# Altium schematic sheet ControllerBoard.SchDoc
size A2
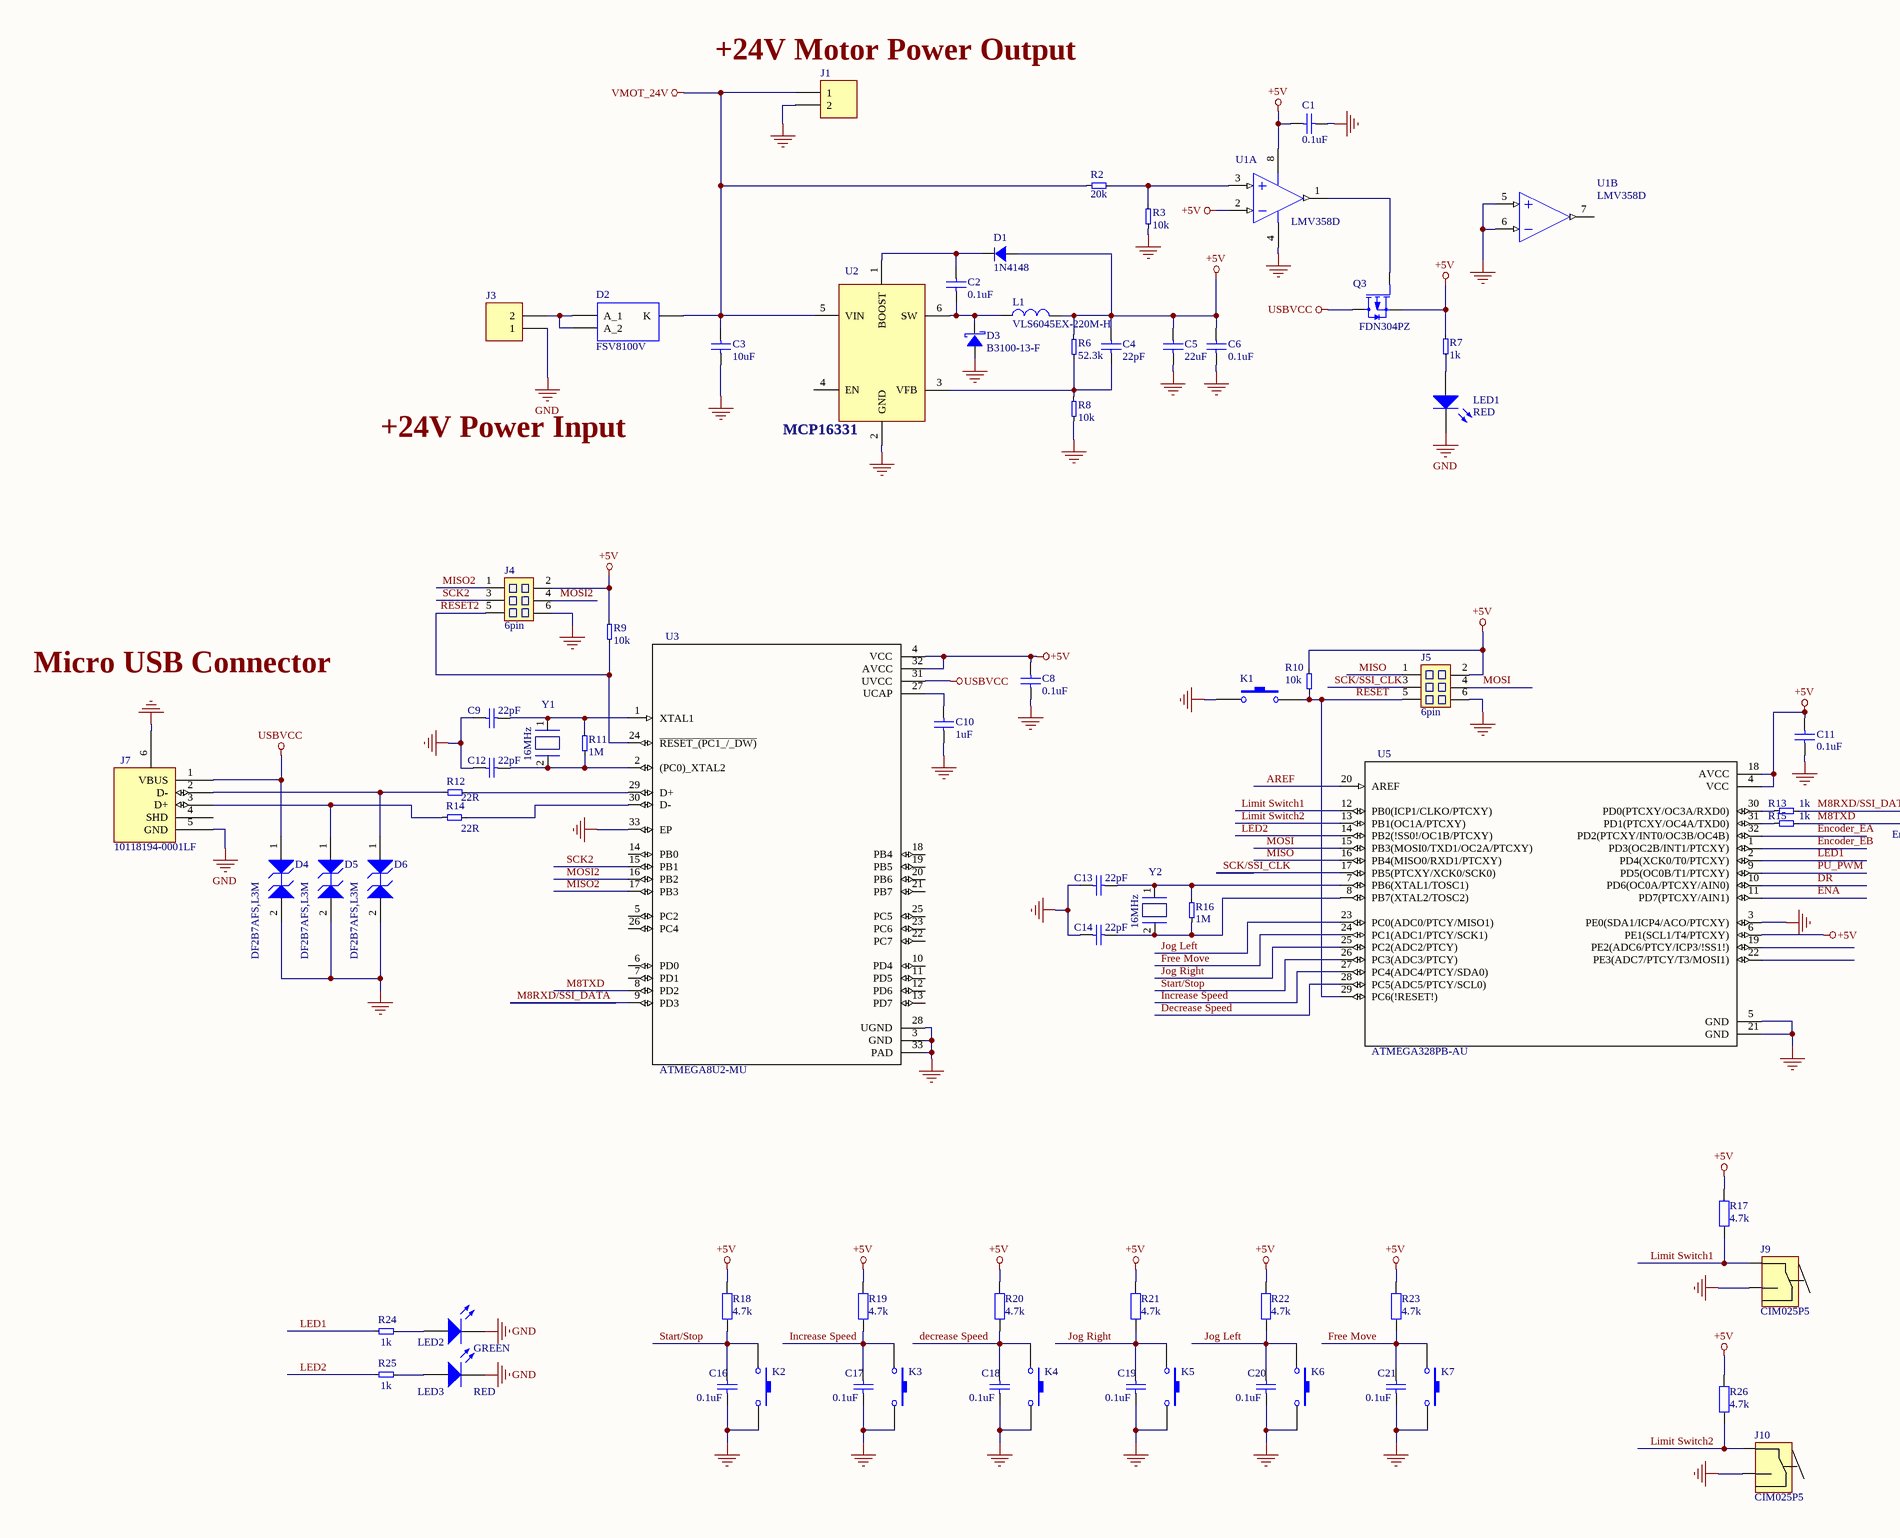
[diagram p0: ControllerBoard.SchDoc, left]
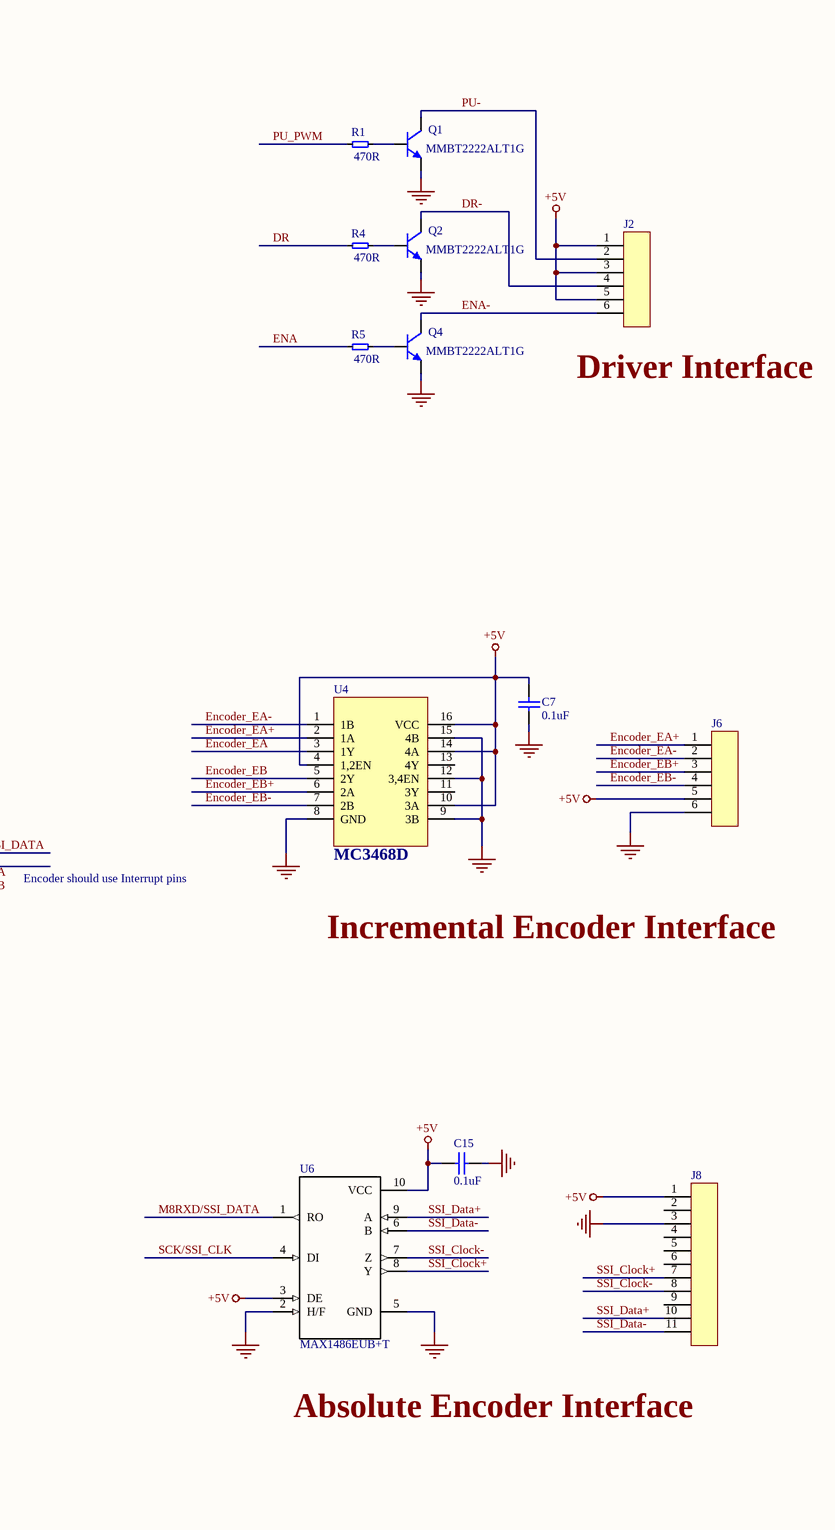
[diagram p1: ControllerBoard.SchDoc, right]

## Parts
C1  0.1uF  [SMD_C(0603)]
C2  0.1uF  [SMD_C(0603)]
C3  10uF  [C1210]
C4  22pF  [SMD_C(0603)]
C5  22uF  [SMD_C(0805)]
C6  0.1uF  [SMD_C(0603)]
C7  0.1uF  [SMD_C(0603)]
C8  0.1uF  [SMD_C(0603)]
C9  22pF  [SMD_C(0603)]
C10  1uF  [SMD_C(0805)]
C11  0.1uF  [SMD_C(0603)]
C12  22pF  [SMD_C(0603)]
C13  22pF  [SMD_C(0603)]
C14  22pF  [SMD_C(0603)]
C15  0.1uF  [SMD_C(0603)]
C16  0.1uF  [SMD_C(0603)]
C17  0.1uF  [SMD_C(0603)]
C18  0.1uF  [SMD_C(0603)]
C19  0.1uF  [SMD_C(0603)]
C20  0.1uF  [SMD_C(0603)]
C21  0.1uF  [SMD_C(0603)]
D1  1N4148  [SODFL1608X70N]
D2  FSV8100V  [TO-277]
D3  B3100-13-F  [DIO_B340-13-F]
D4  DF2B7AFS,L3M  [SOD323]
D5  DF2B7AFS,L3M  [SOD323]
D6  DF2B7AFS,L3M  [SOD323]
J1  CIM025P5  [CON2_P5.08_CIM025P5]  (value not drawn)
J2  796638-6  [TE_3-796638-6]  (value not drawn)
J3  CIM025P5  [CON2_P5.08_CIM025P5]  (value not drawn)
J4  6pin  [Header-2.54m-6pin_1]
J5  6pin  [Header-2.54m-6pin_1]
J6  796638-6  [TE_3-796638-6]  (value not drawn)
J7  10118194-0001LF  [10118194-0001LF]
J8  Molex 501568-1107  [MOLEX_501568-1107]  (value not drawn)
J9  CIM025P5  [CON2_P5.08_CIM025P5]
J10  CIM025P5  [CON2_P5.08_CIM025P5]
K1  BUTTON_DIP  [PUSH BUTTON_MINI(4 PIN)]  (value not drawn)
K2  BUTTON_DIP  [PUSH BUTTON_MINI(4 PIN)]  (value not drawn)
K3  BUTTON_DIP  [PUSH BUTTON_MINI(4 PIN)]  (value not drawn)
K4  BUTTON_DIP  [PUSH BUTTON_MINI(4 PIN)]  (value not drawn)
K5  BUTTON_DIP  [PUSH BUTTON_MINI(4 PIN)]  (value not drawn)
K6  BUTTON_DIP  [PUSH BUTTON_MINI(4 PIN)]  (value not drawn)
K7  BUTTON_DIP  [PUSH BUTTON_MINI(4 PIN)]  (value not drawn)
L1  VLS6045EX-220M-H  [VLS6045EX-220M-H_6.3*6mm]
LED1  RED  [LED0603_1]
LED2  GREEN  [LED0603_1]
LED3  RED  [LED0603_1]
Q1  MMBT2222ALT1G  [SOT23-3]
Q2  MMBT2222ALT1G  [SOT23-3]
Q3  FDN304PZ  [SOT23-3]
Q4  MMBT2222ALT1G  [SOT23-3]
R1  470R  [SMD_R(0603)]
R2  20k  [SMD_R(0603)]
R3  10k  [SMD_R(0603)]
R4  470R  [SMD_R(0603)]
R5  470R  [SMD_R(0603)]
R6  52.3k  [SMD_R(0603)]
R7  1k  [SMD_R(0603)]
R8  10k  [SMD_R(0603)]
R9  10k  [SMD_R(0603)]
R10  10k  [SMD_R(0603)]
R11  1M  [SMD_R(0603)]
R12  22R  [SMD_R(0603)]
R13  1k  [SMD_R(0603)]
R14  22R  [SMD_R(0603)]
R15  1k  [SMD_R(0603)]
R16  1M  [SMD_R(0603)]
R17  4.7k  [SMD_R(0603)]
R18  4.7k  [SMD_R(0603)]
R19  4.7k  [SMD_R(0603)]
R20  4.7k  [SMD_R(0603)]
R21  4.7k  [SMD_R(0603)]
R22  4.7k  [SMD_R(0603)]
R23  4.7k  [SMD_R(0603)]
R24  1k  [SMD_R(0603)]
R25  1k  [SMD_R(0603)]
R26  4.7k  [SMD_R(0603)]
U1  LMV358D  [MSOP-8N]  (parts A,B of 2)
U2  MCP16331  [SOT23-6]
U3  ATMEGA8U2-MU  [Atmega8_QFN50P500X500X100-33N]
U4  MC3468D  [SOIC-16N]
U5  ATMEGA328PB-AU  [Atmega328_QFP80P900X900X120-32N]
U6  MAX1486EUB+T  [MAX1486_SOP50P490X110-10N]
Y1  16MHz  [XTAL_DIP]
Y2  16MHz  [XTAL_DIP]

## Nets
+5V: C1.1 C4.1 C5.1 C6.1 C7.1 C8.1 C11.1 C15.1 D1.2(A) J2.1 J2.3 J2.5 J4.2 J5.2 J6.5 J8.1 L1.2 Q3.2(S) R6.2 R7.1 R9.2 R10.2 R17.1 R18.1 R19.1 R20.1 R21.1 R22.1 R23.1 R26.1 U1.2(IN_A-) U1.8(V+) U3.4(VCC) U3.32(AVCC) U4.4(1,2EN) U4.10(3A) U4.14(4A) U4.16(VCC) U5.4(VCC) U5.6(PE1(SCL1/T4/PTCXY)) U5.18(AVCC) U6.3(DE) U6.10(VCC)
GND: C1.2 C3.1 C5.2 C6.2 C7.2 C8.2 C9.1 C10.2 C11.2 C12.1 C13.1 C14.1 C15.2 C16.2 C17.2 C18.2 C19.2 C20.2 C21.2 D3.A D4.2(A2) D5.2(A2) D6.2(A2) J1.2 J3.1 J4.6 J5.6 J6.6 J7.5(GND) J7.6 J8.3 J9.2(NO) J10.2(NO) K1.1 K2.2 K3.2 K4.2 K5.2 K6.2 K7.2 LED1.2(K) LED2.2(K) LED3.2(K) Q1.2(E) Q2.2(E) Q4.2(E) R3.2 R8.1 U1.4(GND) U1.5(IN_B+) U1.6(IN_B-) U2.2(GND) U3.3(GND) U3.28(UGND) U3.33(EP) U4.8(GND) U4.9(3B) U4.12(3,4EN) U4.15(4B) U5.3(PE0(SDA1/ICP4/ACO/PTCXY)) U5.5(GND) U5.21(GND) U6.2(H/F) U6.5(GND)
USBVCC: D4.1(A1) J7.1(VBUS) Q3.3(D) U3.31(UVCC)
VMOT_24V: C3.2 D2.2(K) J1.1 R2.2 U2.5(VIN)
AREF: U5.20(AREF)
decrease Speed: C18.1 K4.1 R20.2 U5.28(PC5(ADC5/PTCY/SCL0))
DR: R4.1 U5.10(PD6(OC0A/PTCXY/AIN0))
DR-: J2.4 Q2.3(C)
ENA: R5.1 U5.11(PD7(PTCXY/AIN1))
ENA-: J2.6 Q4.3(C)
Encoder_EA: U4.3(1Y) U5.32(PD2(PTCXY/INT0/OC3B/OC4B))
Encoder_EA+: J6.1 U4.2(1A)
Encoder_EA-: J6.2 U4.1(1B)
Encoder_EB: U4.5(2Y) U5.1(PD3(OC2B/INT1/PTCXY))
Encoder_EB+: J6.3 U4.6(2A)
Encoder_EB-: J6.4 U4.7(2B)
Free Move: C21.1 K7.1 R23.2 U5.24(PC1(ADC1/PTCY/SCK1))
Increase Speed: C17.1 K3.1 R19.2 U5.27(PC4(ADC4/PTCY/SDA0))
Jog Left: C20.1 K6.1 R22.2 U5.23(PC0(ADC0/PTCY/MISO1))
Jog Right: C19.1 K5.1 R21.2 U5.25(PC2(ADC2/PTCY))
LED1: R24.1 U5.2(PD4(XCK0/T0/PTCXY))
LED2: R25.1 U5.14(PB2(!SS0!/OC1B/PTCXY))
Limit Switch1: J9.1(COM) R17.2 U5.12(PB0(ICP1/CLKO/PTCXY))
Limit Switch2: J10.1(COM) R26.2 U5.13(PB1(OC1A/PTCXY))
M8RXD/SSI_DATA: R13.1 U3.9(PD3) U6.1(RO)
M8TXD: R15.1 U3.8(PD2)
MISO: J5.1 U5.16(PB4(MISO0/RXD1/PTCXY))
MISO2: J4.1 U3.17(PB3)
MOSI: J5.4 U5.15(PB3(MOSI0/TXD1/OC2A/PTCXY))
MOSI2: J4.4 U3.16(PB2)
PU-: J2.2 Q1.3(C)
PU_PWM: R1.1 U5.9(PD5(OC0B/T1/PTCXY))
RESET: J5.5 K1.2 R10.1 U5.29(PC6(!RESET!))
RESET2: J4.5 R9.1 U3.24(~{RESET_(PC1_/_DW)})
SCK2: J4.3 U3.15(PB1)
SCK/SSI_CLK: J5.3 U5.17(PB5(PTCXY/XCK0/SCK0)) U6.4(DI)
SSI_Clock+: J8.7 U6.8(Y)
SSI_Clock-: J8.8 U6.7(Z)
SSI_Data+: J8.10 U6.9(A)
SSI_Data-: J8.11 U6.6(B)
Start/Stop: C16.1 K2.1 R18.2 U5.26(PC3(ADC3/PTCY))
NetC2_1: C2.1 D1.1(K) U2.1(BOOST)
NetC2_2: C2.2 D3.C L1.1 U2.6(SW)
NetC4_2: C4.2 R6.1 R8.2 U2.3(VFB)
NetC9_2: C9.2 R11.2 U3.1(XTAL1) Y1.1
NetC10_1: C10.1 U3.27(UCAP)
NetC12_2: C12.2 R11.1 U3.2((PC0)_XTAL2) Y1.2
NetC13_2: C13.2 R16.2 U5.7(PB6(XTAL1/TOSC1)) Y2.1
NetC14_2: C14.2 R16.1 U5.8(PB7(XTAL2/TOSC2)) Y2.2
NetD2_1: D2.1(A_1) J3.2
NetD5_1: D5.1(A1) J7.3(D+) R14.1
NetD6_1: D6.1(A1) J7.2(D-) R12.1
NetLED1_1: LED1.1(A) R7.2
NetLED2_1: LED2.1(A) R24.2
NetLED3_1: LED3.1(A) R25.2
NetQ1_1: Q1.1(B) R1.2
NetQ2_1: Q2.1(B) R4.2
NetQ3_1: Q3.1(G) U1.1(OUT_A)
NetQ4_1: Q4.1(B) R5.2
NetR2_1: R2.1 R3.1 U1.3(IN_A+)
NetR12_2: R12.2 U3.29(D+)
NetR13_2: R13.2 U5.30(PD0(PTCXY/OC3A/RXD0))
NetR14_2: R14.2 U3.30(D-)
NetR15_2: R15.2 U5.31(PD1(PTCXY/OC4A/TXD0))

Not connected (* = marked no-connect by the designer): J7 4(SHD); J8 2 4 5 6 9; U1 7(OUT_B); U2 4(EN); U3 5(PC2) 6(PD0) 7(PD1) 10(PD4) 11(PD5) 12(PD6) 13(PD7) 14(PB0) 18(PB4) 19(PB5) 20(PB6) 21(PB7) 22(PC7) 23(PC6) 25(PC5) 26(PC4); U4 11(3Y) 13(4Y); U5 19(PE2(ADC6/PTCY/ICP3/!SS1!)) 22(PE3(ADC7/PTCY/T3/MOSI1))

## Notes on the sheet
- (near J1) +24V Motor Power Output
- (near J2) Driver Interface
- +24V Power Input
- Micro USB Connector
- Encoder should use Interrupt pins
- Incremental Encoder Interface
- Absolute Encoder Interface

## Library data of the parts
C1 C2 C4-C8 C10 C11 C15 = Cap: CAP CER 0.1UF 50V X7R 0603; Manufacturer: Yageo; Manufacturer Part Number: CC0603KPX7R9BB104; Supplier 1: Digi-Key; Supplier Part Number 1: 311-3567-1-ND
C3 = Cap: CAP CER 2.2UF 100V X7R 1210; Manufacturer: Kyocera AVX; Manufacturer Part Number: 12101C225KAT2A; Tolerance: 10%; Dissipation Factor: 2.5%; Supplier 1: Digi-Key; Supplier Part Number 1: 478-7974-1-ND; Stock 1: 31402; Pricing 1: 1=0.8, 10=0.563, 100=0.3708, 500=0.27464 (USD); Mount: Surface Mount; Case/Package: 1210; Number of Pins: 2; Case Code (Imperial): 1210; Case Code (Metric): 3225; Contact Plating: Tin,Matte; Min Operating Temperature: -55°C; Max Operating Temperature: 125°C; Voltage Rating: 100V; Capacitance: 2.2uF; Package Quantity: 1; Voltage Rating (DC): 100V; Packaging: Tape and Reel; Dielectric: X7R; Termination: SMD/SMT; Voltage: 100V; Length: 3.2mm; Height: 2.79mm; Width: 2.5mm; Thickness: 0.11inch; Depth: 2.5mm; Radiation Hardening: No; Lead Free: Lead Free; REACH SVHC: No SVHC; ComponentLink1URL: http://www.farnell.com/datasheets/1818074.pdf?src-supplier=Element14; ComponentLink1Description: http://www.farnell.com/datasheets/1818074.pdf?src-supplier=Element14; ComponentLink2URL: http://catalogs.avx.com/SurfaceMount.pdf?src-supplier=Digi-Key; ComponentLink2Description: http://catalogs.avx.com/SurfaceMount.pdf?src-supplier=Digi-Key; ComponentLink3URL: http://www.farnell.com/datasheets/1679506.pdf?src-supplier=Element14; ComponentLink3Description: http://www.farnell.com/datasheets/1679506.pdf?src-supplier=Element14
C9 C12-C14 = Cap: CAP CER 27PF 50V C0G/NP0 0603; Manufacturer: Walsin Technologies; Manufacturer Part Number: 0603N270J500CT; Tolerance: 5%; Dielectric: C0G; Insulation Resistance: 10GR; Supplier 1: Digi-Key; Supplier Part Number 1: 1292-1511-1-ND; Stock 1: 158614; Pricing 1: 1=0.1, 10=0.033, 100=0.0149, 500=0.01062, 1000=0.00835 (USD); Case/Package: 0603; Case Code (Metric): 1608; Case Code (Imperial): 0603; Min Operating Temperature: -55°C; Max Operating Temperature: 125°C; Voltage Rating: 50V; Capacitance: 27pF; Packaging: Tape and Reel; Voltage Rating (DC): 50V; Length: 1.6mm; Depth: 0.8mm; Radiation Hardening: No; REACH SVHC: Unknown; Lead Free: Lead Free; ComponentLink1URL: https://www.verical.com/server-webapp/html/getDatasheet?partID=753102&src-supplier=Verical; ComponentLink1Description: https://www.verical.com/server-webapp/html/getDatasheet?partID=753102&src-supplier=Verical
C16-C21 = Cap: Capacitor; Value: 50V; Published: 8-Jun-2000; LatestRevisionDate: 17-Jul-2002; LatestRevisionNote: Re-released for DXP Platform.; PackageReference: RAD-0.3; Publisher: Altium Limited; PackageDescription: Radial Cap, Thru-Hole; 2 Leads; 0.3 in Pin Spacing
D1 = Diode: Note: Terminal 2 is the TAB and is electrically connected to the cathode; Published: 8-Jun-2000; LatestRevisionDate: 17-Jul-2002; LatestRevisionNote: Re-released for DXP Platform.; DatasheetVersion: PD-2.057B; PackageVersion: Feb-1998; PackageReference: TO-220AC; Publisher: Altium Limited; PackageDescription: TO, Thru-Hole, Vertical, Heatsink Mounted; 3 In-Line Leads (1 Absent); Pitch 2.54 mm; ComponentLink1Description: Manufacturer Link; ComponentLink1URL: http://www.irf.com/; ComponentLink2Description: Datasheet; ComponentLink2URL: http://www.irf.com/product-info/datasheets/data/10tq.pdf
D2 = PDS760Q-13: DIODE SCHOTTKY 100V 8A TO-277; Manufacturer: ON; Supplier 1: Digi-Key; Supplier Part Number 1: FSV8100VCT-ND; Manufacturer Part Number: FSV8100V
D3 = Diode 10TQ035: Schottky Rectifier; Note: Terminal 2 is the TAB and is electrically connected to the cathode; Published: 8-Jun-2000; LatestRevisionDate: 17-Jul-2002; LatestRevisionNote: Re-released for DXP Platform.; DatasheetVersion: PD-2.057B; PackageVersion: Feb-1998; PackageReference: TO-220AC; Publisher: Altium Limited; PackageDescription: TO, Thru-Hole, Vertical, Heatsink Mounted; 3 In-Line Leads (1 Absent); Pitch 2.54 mm; ComponentLink1Description: Manufacturer Link; ComponentLink1URL: http://www.irf.com/; ComponentLink2Description: Datasheet; ComponentLink2URL: http://www.irf.com/product-info/datasheets/data/10tq.pdf
D4-D6 = DF2B7AFS,L3M: BIDIRECTIONAL ESD DIODE VRWM=+/-; Manufacturer: Toshiba; Manufacturer Part Number: DF2B7AFU,H3F; Supplier 1: Digi-Key; Supplier Part Number 1: DF2B7AFUH3FCT-ND
J1 J3 = Header 2: TERM BLK 2P SIDE ENT 5.08MM PCB; Manufacturer: Sauro; Manufacturer Part Number: CIM025P5; Supplier 1: Digi-Key
J2 J6 = 6PinConnector: 3PinConnector
J4 J5 = 6PinConnector_1
J7 = 10118194-0001LF: CONN RCPT USB2.0 MICRO B SMD R/A; Manufacturer: Amphenol FCI; Gender: Receptacle; Current Rating: 1.8A; Connector Type: USB,Receptacle; Number of Contacts: 5; Insulation Resistance: 1GR; Number of Ports: 1; Max Voltage Rating (AC): 100V; Pitch: 0.65mm; Supplier 1: Digi-Key; Supplier Part Number 1: 609-4618-1-ND; Manufacturer Part Number: 10118194-0001LF; Stock 1: 145984; Pricing 1: 1=0.42, 10=0.393, 25=0.3536, 50=0.3144, 100=0.3013, 250=0.27512, 500=0.26202 (USD); Mount: Surface Mount,Horizontal; Contact Material: Copper Alloy; Contact Plating: Gold; Number of Terminals: 5; Housing Material: Polymer; Color: Black; Min Operating Temperature: -55°C; Max Operating Temperature: 85°C; Package Quantity: 9600; Packaging: Tape and Reel; Termination: Solder; Orientation: Right Angle; Features: Shielded; Length: 8.05mm; Depth: 5mm; Radiation Hardening: No; Lead Free: Lead Free; Flammability Rating: UL94 V-0; ComponentLink1URL: http://www.amphenol-icc.com/media/wysiwyg/files/drawing/10118194.pdf?src-supplier=Digi-Key; ComponentLink1Description: http://www.amphenol-icc.com/media/wysiwyg/files/drawing/10118194.pdf?src-supplier=Digi-Key; ComponentLink2URL: https://cdn.amphenol-icc.com/media/wysiwyg/files/drawing/10118194.pdf?src-supplier=Mouser; ComponentLink2Description: https://cdn.amphenol-icc.com/media/wysiwyg/files/drawing/10118194.pdf?src-supplier=Mouser; ComponentLink3URL: https://cdn.amphenol-icc.com/media/wysiwyg/files/drawing/10118194.pdf?src-supplier=Avnet; ComponentLink3Description: https://cdn.amphenol-icc.com/media/wysiwyg/files/drawing/10118194.pdf?src-supplier=Avnet; ComponentLink4URL: https://cdn.amphenol-icc.com/media/wysiwyg/files/drawing/10118194.pdf?src-supplier=Verical; ComponentLink4Description: https://cdn.amphenol-icc.com/media/wysiwyg/files/drawing/10118194.pdf?src-supplier=Verical
J8 = 11Pin Connector: 3PinConnector
J9 J10 = End Stop Switch
K1-K7 = SW-PB: 2 Pin Mini Push Button Switch; Published: 24-Mar-1999; LatestRevisionDate: 17-Jul-2002; LatestRevisionNote: Re-released for DXP Platform.; PackageReference: SPST-2; Publisher: Altium Limited; PackageDescription: Switch; 2 Leads
L1 = Inductor: Code_IEC: 1005; Published: 8-Jun-2000; LatestRevisionDate: 29-May-2009; LatestRevisionNote: IPC-7351 Footprint Added.; PackageReference: 0402-A; Publisher: Altium Limited; PackageDescription: Chip Inductor; Code_JEITA: 0402
LED1 LED2 = LED_0402: LED YELLOW CLEAR CHIP SMD; Manufacturer: Lite-On Inc.; Manufacturer Part Number: LTST-C193KSKT-5A; Supplier 1: Digi-Key; Supplier Part Number 1: 160-1831-1-ND
LED3 = LED_0402: LED RED CLEAR 2SMD; Manufacturer: Everlight Electronics Co Ltd; Manufacturer Part Number: 19-217/R6C-AL1M2VY/3T; Supplier 1: Digi-Key; Supplier Part Number 1: 1080-1585-1-ND
Q1 Q2 Q4 = NPN: NPN Bipolar Transistor; Published: 8-Jun-2000; LatestRevisionDate: 17-Jul-2002; LatestRevisionNote: Re-released for DXP Platform.; PackageReference: TO-226-AA; Publisher: Altium Limited; PackageDescription: TO, Flat Index; 3 In-Line, Axial Leads; Body Dia. 4.8mm; Leads 0.55 x 0.51 mm (max); Code_JEDEC: TO-226-AA
Q3 = MOSFET-P: P-Channel MOSFET; Published: 8-Jun-2000; LatestRevisionDate: 17-Jul-2002; LatestRevisionNote: Re-released for DXP Platform.; PackageVersion: 1995/1996; PackageReference: E3; Publisher: Altium Limited; PackageDescription: TO, Flat Index; 3 In-Line, Axial Leads; Body Dia. 4.6mm; Lead Dia. 0.5 mm (max)
R1-R11 R13 R15 R16 R24 R25 = R_0402: RES SMD 470 OHM 1% 1/10W 0603; Manufacturer: Yageo; Manufacturer Part Number: RC0603FR-07470RL; Supplier 1: Digi-Key; Supplier Part Number 1: 311-470HRCT-ND
R12 R14 = R_0402: RES SMD 0 OHM JUMPER 1/10W 0603; Manufacturer: Yageo; Manufacturer Part Number: RC0603JR-070RL; ComponentLink1URL: http://www.yageo.com/documents/recent/PYu-RC_Group_51_RoHS_L_10.pdf?src-supplier=Digi-Key; ComponentLink1Description: http://www.yageo.com/documents/recent/PYu-RC_Group_51_RoHS_L_10.pdf?src-supplier=Digi-Key; ComponentLink2URL: http://www.yageo.com/documents/recent/PYu-RC0402_51_RoHS_L_6.pdf?src-supplier=Avnet+Europe; ComponentLink2Description: http://www.yageo.com/documents/recent/PYu-RC0402_51_RoHS_L_6.pdf?src-supplier=Avnet+Europe; ComponentLink3URL: http://www.farnell.com/datasheets/1018594.pdf?src-supplier=Element14; ComponentLink3Description: http://www.farnell.com/datasheets/1018594.pdf?src-supplier=Element14; ComponentLink4URL: https://www.verical.com/server-webapp/html/getDatasheet?partID=326379&src-supplier=Verical; ComponentLink4Description: https://www.verical.com/server-webapp/html/getDatasheet?partID=326379&src-supplier=Verical; ComponentLink5URL: http://www.farnell.com/datasheets/2167052.pdf?src-supplier=Element14; ComponentLink5Description: http://www.farnell.com/datasheets/2167052.pdf?src-supplier=Element14; Supplier 1: Digi-Key; Supplier Part Number 1: 311-0.0GRCT-ND
R17-R23 R26 = Res2: Resistor; Published: 8-Jun-2000; LatestRevisionDate: 17-Jul-2002; LatestRevisionNote: Re-released for DXP Platform.; PackageReference: AXIAL-0.4; Publisher: Altium Limited; PackageDescription: Axial Device, Thru-Hole; 2 Leads; 0.4 in Pin Spacing
U1 = Op Amp: Linear Operational Amplifier; Published: 8-Jun-2000; LatestRevisionDate: 17-Jul-2002; LatestRevisionNote: Re-released for DXP Platform.; DatasheetVersion: REV. B; PackageVersion: 1990; PackageReference: H-08A; Publisher: Altium Limited; PackageDescription: Can; 8 Leads; Pin Circle Dia. 5.08 mm; Lead Dia. 0.53 mm (max); ComponentLink1Description: Manufacturer Link; ComponentLink1URL: http://www.analog.com/
U2 = MCP16331: Step down Converter Chip
U3 = ATMEGA8U2-MU: AVR AVRÂ® ATmega Microcontroller IC 8-Bit 16MHz 8KB _4K x 16_ FLASH 32-VQFN _5x5_; MF: Microchip; Price: None; Availability: Unavailable; SnapEDA_Link: https://www.snapeda.com/parts/ATMEGA8U2-MU/Microchip/view-part/1757717/?ref=snap; MP: ATMEGA8U2-MU; Package: VQFN-32 Microchip; Value: *
U4 = MC3468D: Line Receiver
U5 = ATMEGA328PB-AU: AVR AVRÂ® ATmega Microcontroller IC 8-Bit 20MHz 32KB _16K x 16_ FLASH 32-TQFP _7x7_; MF: Microchip Technology; Package: TQFP-32 Microchip Technology; Availability: Unavailable; SnapEDA_Link: https://www.snapeda.com/parts/ATMEGA328PB-AU/Microchip/view-part/4478285/?ref=snap; MP: ATMEGA328PB-AU; Price: None; Value: *
U6 = MAX1486EUB+T: Single Transmitter/Receiver RS-422/RS-485 10-Pin uMAX; MF: Maxim Integrated; MP: MAX1486EUB; Price: None; SnapEDA_Link: https://www.snapeda.com/parts/MAX1486EUB/Maxim%20Integrated/view-part/49984/?ref=snap; Package: None; Availability: Unavailable; Value: *
Y1 Y2 = XTAL: CRYSTAL 12.0000MHZ 18PF T/H; Manufacturer_Name: ABRACON; Manufacturer_Part_Number: ABL-12.000MHZ-B2; Frequency Tolerance: 20ppm; Frequency: 12MHz; ESR (Equivalent Series Resistance): 50R; Frequency Stability: 50ppm; RS Part Number: *; RS Price/Stock: *; Arrow Part Number: ABL-12.000MHZ-B2; Arrow Price/Stock: https://www.arrow.com/en/products/abl-12.000mhz-b2/abracon; Datasheet Link: https://abracon.com/Resonators/ABL.pdf; Supplier 1: Digi-Key; Supplier Part Number 1: 535-9037-ND; Manufacturer: Abracon; Manufacturer Part Number: ABL-12.000MHZ-B2; Stock 1: 3252; Pricing 1: 1=0.33, 10=0.275, 50=0.2476, 100=0.22, 500=0.209, 1000=0.176, 2500=0.165, 5000=0.1595, 10000=0.154 (USD); Mount: Through Hole; Number of Pins: 2; Min Operating Temperature: -20°C; Max Operating Temperature: 70°C; Load Capacitance: 18pF; Package Quantity: 1000; Packaging: Bulk; Tolerance: 20ppm; Termination: Radial; Series Resistance: 50R; Length: 0.453inch; Height: 0.138inch; Width: 0.197inch; Radiation Hardening: No; REACH SVHC: No SVHC; Lead Free: Lead Free; ComponentLink1URL: https://abracon.com/Resonators/ABL.pdf?src-supplier=Digi-Key; ComponentLink1Description: https://abracon.com/Resonators/ABL.pdf?src-supplier=Digi-Key; ComponentLink2URL: http://www.farnell.com/datasheets/1359171.pdf?src-supplier=Element14; ComponentLink2Description: http://www.farnell.com/datasheets/1359171.pdf?src-supplier=Element14